# EAGLE design tama2 (1) (EAGLE 6.5.0)
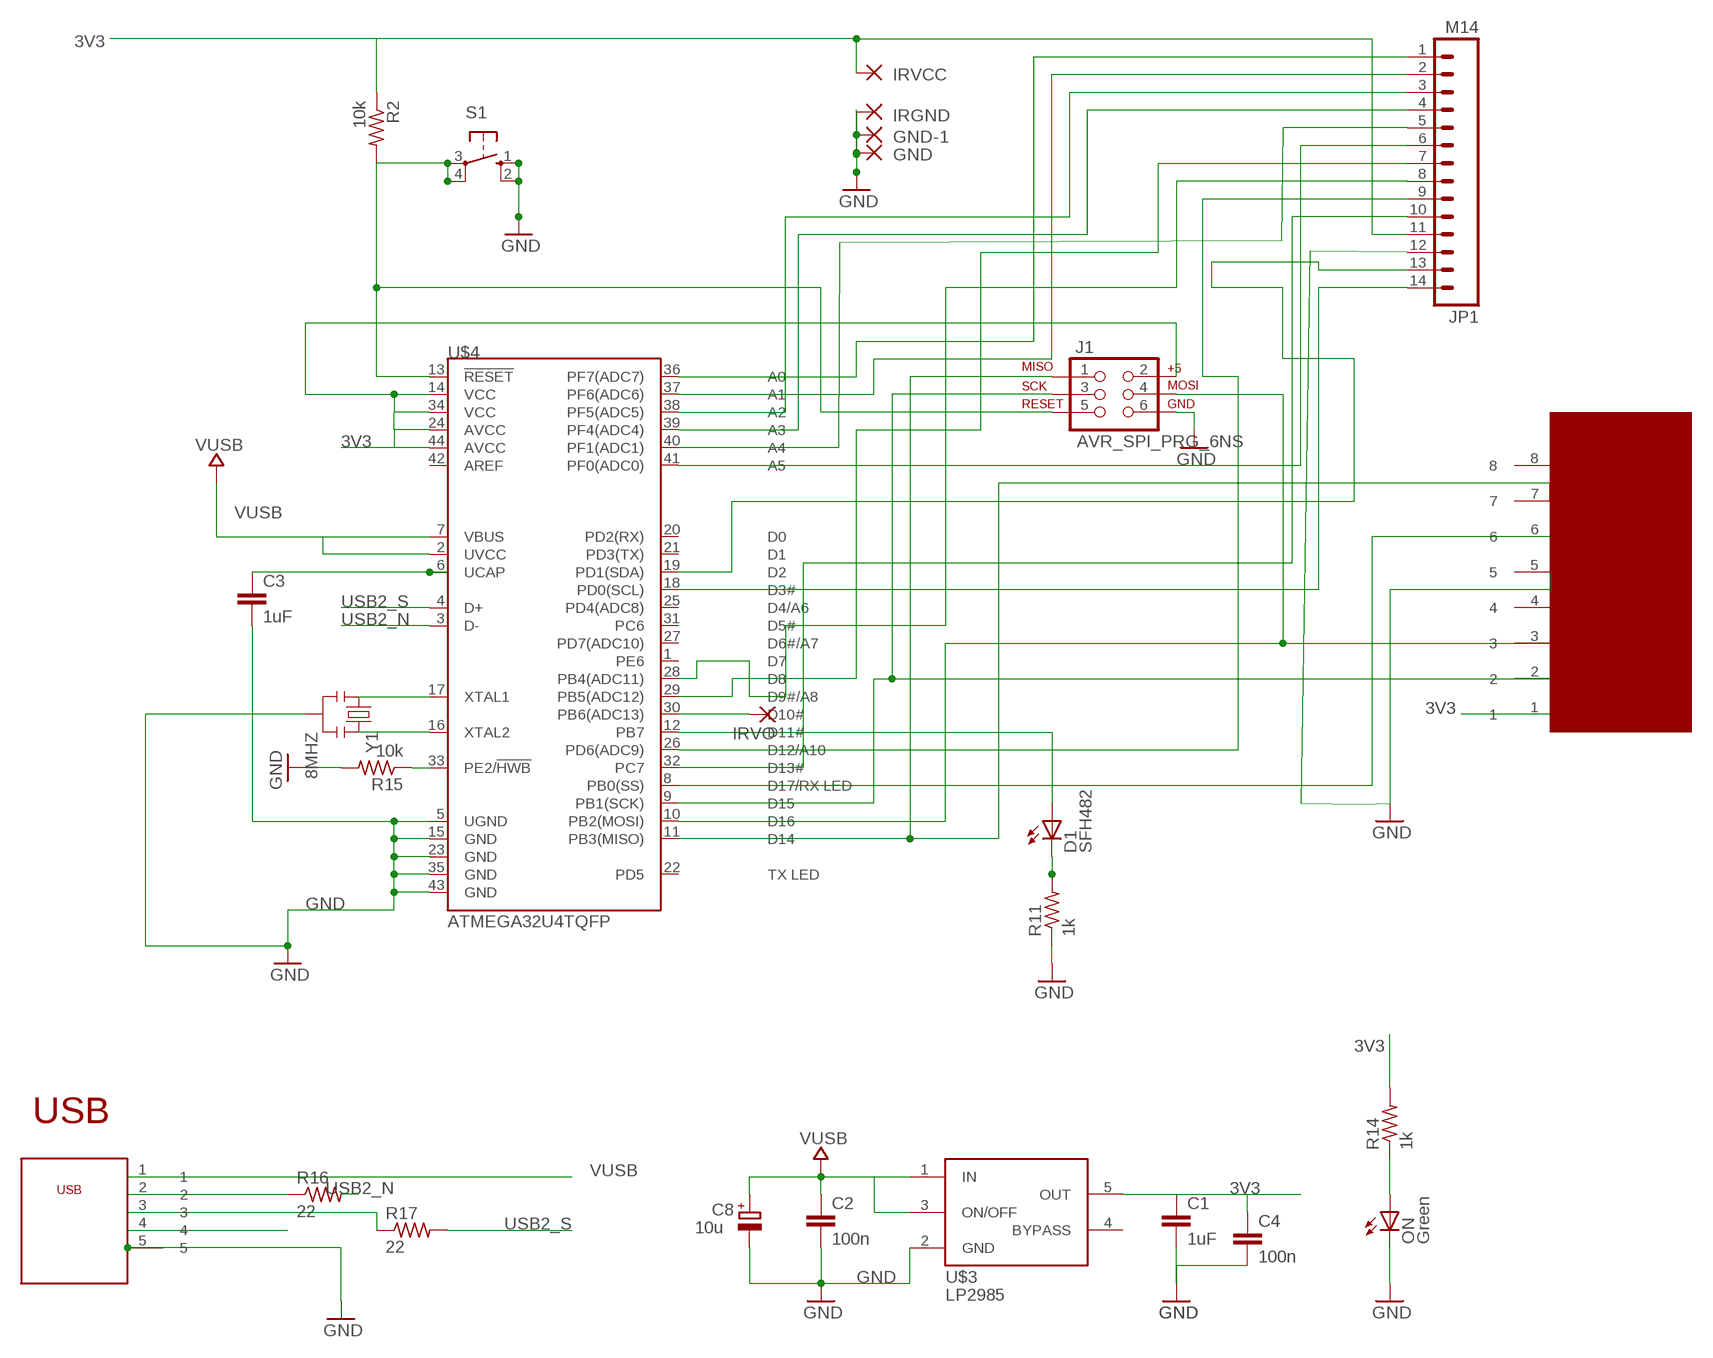
[diagram p0: schematic, sheet 1]

## Parts
C1  1uF  C-EUC1206  [C1206]
C2  100n  C-EUC1206  [C1206]
C3  1uF  C-EUC1206  [C1206]
C4  100n  C-EUC1206  [C1206]
C8  10u  CPOL-EUSMCB  [SMC_B]
D1  SFH482  [SFH482]
GND  2,15/1,0  [2,15/1,0]
GND-1  2,15/1,0  [2,15/1,0]
IRGND  2,15/1,0  [2,15/1,0]
IRVCC  2,15/1,0  [2,15/1,0]
IRVO  2,15/1,0  [2,15/1,0]
J1  AVR_SPI_PRG_6NS  [2X3-NS]
JP1  M14  [1X14]
ON  Green  LEDCHIPLED_0805  [CHIPLED_0805]
R2  10k  R-US_R1206  [R1206]
R11  1k  R-US_R1206  [R1206]
R14  1k  R-US_R1206  [R1206]
R15  10k  R-US_R1206  [R1206]
R16  22  R-US_R1206  [R1206]
R17  22  R-US_R1206  [R1206]
S1  10-XX  [B3F-10XX]
U$1  TAMA  [TAMACONTACT]
U$2  USB  [USB]
U$3  LP2985  [SOT23-5]
U$4  ATMEGA32U4TQFP  [SPARKFUN-DIGITALIC_TQFP44]
Y1  8MHZ  RESONATOR8MHZ  [RESONATOR-SMD]

## Nets
3V3: C1.1 C4.1 IRVCC.1(P) J1.2 JP1.11 R2.1 R14.2 U$1.1 U$3.5(OUT) U$4.14(VCC) U$4.24(AVCC) U$4.34(VCC) U$4.44(AVCC)
GND [gnd]: C1.2 C2.2 C3.2 C4.2 C8.- GND-1.1(P) GND.1(P) IRGND.1(P) J1.6 JP1.12 ON.C R11.1 R15.2 S1.1(S) S1.2(S1) U$1.5 U$2.5 U$3.2(GND) U$4.5(UGND) U$4.15(GND) U$4.23(GND) U$4.35(GND) U$4.43(GND) Y1.2
N$3: ON.A R14.1
N$7: D1.K(C) R11.2
N$15: R15.1 U$4.33(PE2/!HWB)
PB0: U$1.6 U$4.8(PB0(SS))
PB1: J1.3 U$1.2 U$4.9(PB1(SCK))
PB2: J1.4 U$1.3 U$4.10(PB2(MOSI))
PB3: J1.1 U$1.7 U$4.11(PB3(MISO))
PB4: JP1.8 U$4.28(PB4(ADC11))
PB5: JP1.7 U$4.29(PB5(ADC12))
PB6: IRVO.1(P) U$4.30(PB6(ADC13))
PB7: D1.A U$4.12(PB7)
PC7: JP1.10 U$4.32(PC7)
PD0: JP1.14 U$4.18(PD0(SCL))
PD1: JP1.13 U$4.19(PD1(SDA))
PD6: JP1.9 U$4.26(PD6(ADC9))
PF0: JP1.6 U$4.41(PF0(ADC0))
PF1: JP1.5 U$4.40(PF1(ADC1))
PF4: JP1.4 U$4.39(PF4(ADC4))
PF5: JP1.3 U$4.38(PF5(ADC5))
PF6: JP1.2 U$4.37(PF6(ADC6))
PF7: JP1.1 U$4.36(PF7(ADC7))
RESET [usbvcc]: J1.5 R2.2 S1.3(P) S1.4(P1) U$4.13(!RESET)
UCAP: C3.1 U$4.6(UCAP)
USB2_N: R16.2 U$4.3(D-)
USB2_S: R17.2 U$4.4(D+)
USB_N: R16.1 U$2.2
USB_Q: R17.1 U$2.3
USBID: U$2.4
VUSB: C2.1 C8.+ U$2.1 U$3.1(IN) U$3.3(ON/OFF) U$4.2(UVCC) U$4.7(VBUS)
XTAL1: U$4.17(XTAL1) Y1.1
XTAL2: U$4.16(XTAL2) Y1.3
Unconnected: U$1.4 U$1.8 U$3.4(BYPASS) U$4.1(PE6) U$4.20(PD2(RX)) U$4.21(PD3(TX)) U$4.22(PD5) U$4.25(PD4(ADC8)) U$4.27(PD7(ADC10)) U$4.31(PC6) U$4.42(AREF)

## Notes on the sheet
- USB
- C:/Users/Natalie/Documents/egg.bmp

## Library data of the parts
C1-C4 = rcl:C-EU: CAPACITOR, European symbol
C8 = rcl:CPOL-EU: POLARIZED CAPACITOR, European symbol
D1 = led:SFH482: IR LED infrared emitting diode, Infineon
GND GND-1 IRGND IRVCC IRVO = wirepad:2,15/1,0: THROUGH-HOLE PAD
J1 = SparkFun-Connectors:AVR_SPI_PRG_6: AVR ISP 6 Pin This is the reduced ISP connector for AVR programming. Common on Arduino. This footprint will take up less PCB space and can be used with a 10-pin to 6-pin adapter such as SKU: BOB-08508
JP1 = SparkFun-Connectors:M14: Header 14 Standard 14-pin 0.1" header. Use with straight break away headers (SKU : PRT-00116), right angle break away headers (PRT-00553), swiss pins (PRT-00743), machine pins (PRT-00117), and female headers (PRT-00115).
ON = led:LED: LED OSRAM: - CHIPLED LG R971, LG N971, LY N971, LG Q971, LY Q971, LO R971, LY R971 LH N974, LH R974 LS Q976, LO Q976, LY Q976 LO Q996 - Hyper CHIPLED LW Q18S LB Q993, LB Q99A, LB R99A - SideLED LS A670, LO A670, LY A670, LG A670, LP A670 LB A673, LV A673, LT A673, LW A673 LH A674 LY A675 LS A676, LA A676, LO A676, LY A676, LW A676 LS A679, LY A679, LG A679 - Hyper Micro SIDELED® LS Y876, LA Y876, LO Y876, LY Y876 LT Y87S - SmartLED LW L88C, LW L88S LB L89C, LB L89S, LG L890 LS L89K, LO L89K, LY L89K LS L896, LA L896, LO L896, LY L896 - TOPLED LS T670, LO T670, LY T670, LG T670, LP T670 LSG T670, LSP T670, LSY T670, LOP T670, LYG T670 LG T671, LOG T671, LSG T671 LB T673, LV T673, LT T673, LW T673 LH T674 LS T676, LA T676, LO T676, LY T676, LB T676, LH T676, LSB T676, LW T676 LB T67C, LV T67C, LT T67C, LS T67K, LO T67K, LY T67K, LW E67C LS E67B, LA E67B, LO E67B, LY E67B, LB E67C, LV E67C, LT E67C LW T67C LS T679, LY T679, LG T679 LS T770, LO T770, LY T770, LG T770, LP T770 LB T773, LV T773, LT T773, LW T773 LH T774 LS E675, LA E675, LY E675, LS T675 LS T776, LA T776, LO T776, LY T776, LB T776 LHGB T686 LT T68C, LB T68C - Hyper Mini TOPLED® LB M676 - Mini TOPLED Santana® LG M470 LS M47K, LO M47K, LY M47K Source: http://www.osram.convergy.de LUXEON: - LUMILED® LXK2-PW12-R00, LXK2-PW12-S00, LXK2-PW14-U00, LXK2-PW14-V00 LXK2-PM12-R00, LXK2-PM12-S00, LXK2-PM14-U00 LXK2-PE12-Q00, LXK2-PE12-R00, LXK2-PE12-S00, LXK2-PE14-T00, LXK2-PE14-U00 LXK2-PB12-K00, LXK2-PB12-L00, LXK2-PB12-M00, LXK2-PB14-N00, LXK2-PB14-P00, LXK2-PB14-Q00 LXK2-PR12-L00, LXK2-PR12-M00, LXK2-PR14-Q00, LXK2-PR14-R00 LXK2-PD12-Q00, LXK2-PD12-R00, LXK2-PD12-S00 LXK2-PH12-R00, LXK2-PH12-S00 LXK2-PL12-P00, LXK2-PL12-Q00, LXK2-PL12-R00 Source: www.luxeon.com KINGBRIGHT: KA-3528ASYC Source: www.kingbright.com
R2 R11 R14-R17 = resistor:R-US_: RESISTOR, American symbol
S1 = switch-omron:10-XX: OMRON SWITCH; MPN: B3F-1000; OC_FARNELL: 176432; OC_NEWARK: 36M3542
U$1 = tama:TAMA
U$2 = usb:USB
U$3 = kris-verified:LP2985
U$4 = SparkFun-DigitalIC:ATMEGA32U4: Atmel 44-pin 8-bit Microcontroller with 32KBytes of ISP Flash and USB Controller ----- Please use the QFN-44-NOPAD_1:1 package for the footprint of all boards using a 32U4. Route traces directly away from the pads as much as possible.
Y1 = SparkFun-FreqCtrl:RESONATOR: Resonator Small SMD resonator. Used, eg, on the Arduino Pro/ Pro Mini boards. 8MHz- XTAL-08895 16MHz- XTAL-08900; PROD_ID: XTAL-08895

## Net classes
0 default: width 0.254 mm, drill 0.61 mm, clearance 0.254 mm
1 power: width 0.254 mm, drill 0.61 mm, clearance 0.254 mm
2 gnd: width 0.254 mm, drill 0.61 mm, clearance 0.254 mm
3 usbvcc: width 0.254 mm, drill 0.61 mm, clearance 0.254 mm
4 aref: width 0.254 mm, drill 0.61 mm, clearance 0.254 mm

## Board
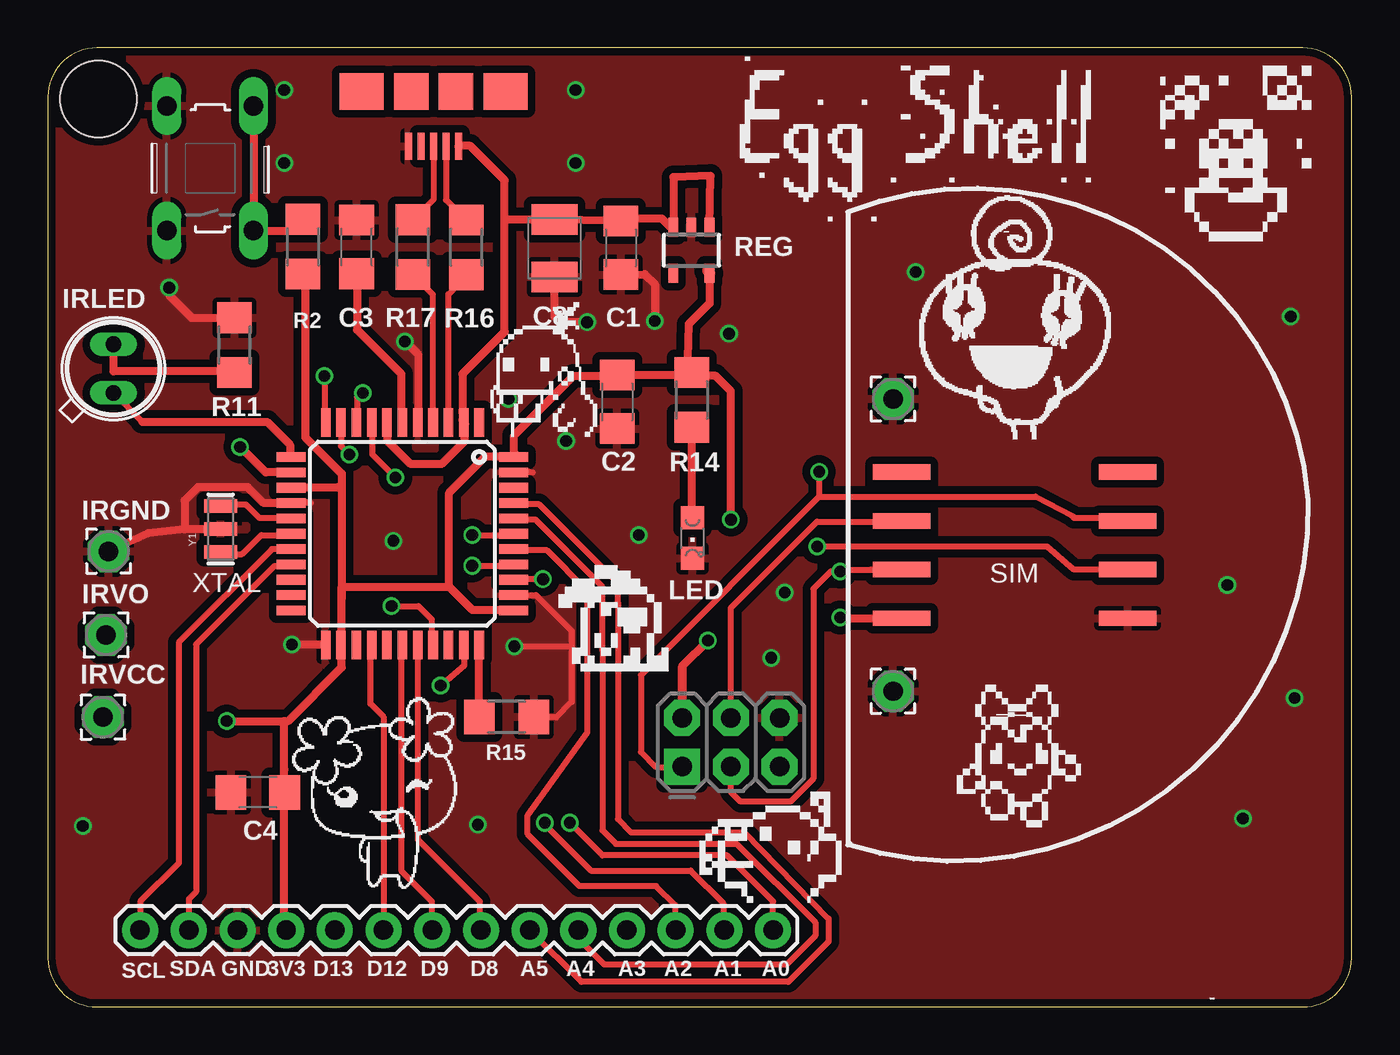
[diagram p1: board, top side]
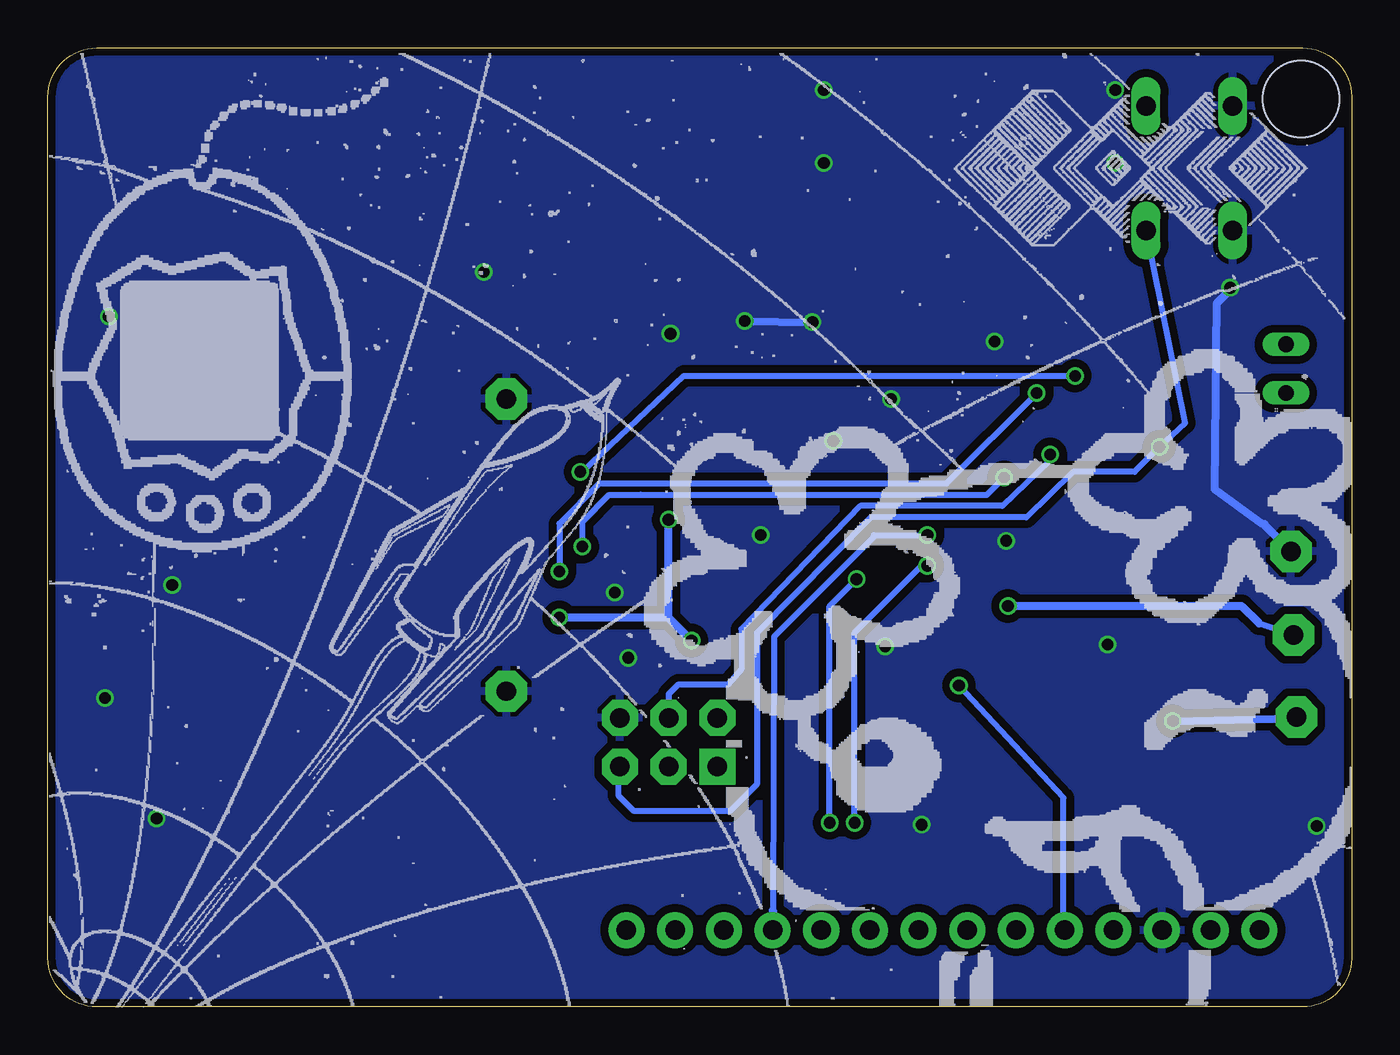
[diagram p2: board, bottom side, seen from below]

Size 68 x 50 mm. Coordinates in mm from the lower left corner, seen from the top.
Outline: 0,47.46 0,2.54 arc90 2.54,0 65.46,0 arc90 68,2.54 68,47.46 arc90 65.46,50 2.54,50 arc90 0,47.46
Copper layers (1*2*15*16): Top 0.035mm / dielectric 0.2mm / layer 2 0.0175mm / dielectric 1.1mm / layer 15 0.0175mm / dielectric 0.2mm / Bottom 0.035mm
Design rules "SeeedStudio_DRU_no_angle_20130527": minimum track width 6mil, minimum drill 12mil, track to track 6mil, track to pad 6mil, pad to pad 6mil, via to via 6mil, smd to smd 0mil, copper to edge 10mil, drill to drill 10mil, minimum pad ring 6mil, minimum via ring 6mil, stop-mask expansion 2mil, vias tented up to drill 25mil, thermal gap 10mil
Holes 4 mm at 2.64,47.35

### Footprints (pad centres in the part's own frame; a part is rotated, then mirrored left to right if it is on the bottom)
C1206 = smd 1.6 x 1.8: 1 -1.4,0; 2 1.4,0
SMC_B = smd 1.6 x 2.4: + -1.5,0; - 1.5,0
SFH482 = drill 0.813 long: A -1.27,0; K 1.27,0
2,15/1,0 = drill 1.016 pad 2.159 octagon: 1 0,0
2X3-NS = drill 1.016 pad 1.88 square: 1 -2.54,-1.27 | drill 1.016 pad 1.88 octagon: 2 -2.54,1.27; 3 0,-1.27; 4 0,1.27; 5 2.54,-1.27; 6 2.54,1.27
1X14 = drill 1.016 pad 1.88: 1 0,0; 2 2.54,0; 3 5.08,0; 4 7.62,0; 5 10.16,0; 6 12.7,0; 7 15.24,0; 8 17.78,0; 9 20.32,0; 10 22.86,0; 11 25.4,0; 12 27.94,0; 13 30.48,0; 14 33.02,0
CHIPLED_0805 = smd 1.2 x 1.2: A 0,-1.05; C 0,1.05
R1206 = smd 1.6 x 1.803: 1 -1.422,0; 2 1.422,0
B3F-10XX = drill 1.016 long: 1 -3.251,2.261; 2 3.251,2.261; 3 -3.251,-2.261; 4 3.251,-2.261
TAMACONTACT = smd 3 x 0.8: 1 0,1.81; 2 0,4.35; 3 0,6.89; 4 0,9.43; 5 11.8,1.81; 6 11.8,4.35; 7 11.8,6.89; 8 11.8,9.43
USB = smd 0.38 x 1.4: 1 -1.3,2.85; 2 -0.65,2.85; 3 0,2.85; 4 0.65,2.85; 5 1.3,2.85 | smd 1.8 x 1.9: P$1 -1.15,0; P$2 1.15,0 | smd 2.3 x 1.9: P$3 -3.75,0; P$5 3.75,0
SOT23-5 = smd 0.5 x 1: 1 -0.95,-1.2; 2 0,-1.2; 3 0.95,-1.2; 4 0.95,1.2; 5 -0.95,1.2
SPARKFUN-DIGITALIC_TQFP44 = smd 1.5 x 0.5: 1 -5.8,4; 2 -5.8,3.2; 3 -5.8,2.4; 4 -5.8,1.6; 5 -5.8,0.8; 6 -5.8,0; 7 -5.8,-0.8; 8 -5.8,-1.6; 9 -5.8,-2.4; 10 -5.8,-3.2; 11 -5.8,-4; 23 5.8,-4; 24 5.8,-3.2; 25 5.8,-2.4; 26 5.8,-1.6; 27 5.8,-0.8; 28 5.8,0; 29 5.8,0.8; 30 5.8,1.6; 31 5.8,2.4; 32 5.8,3.2; 33 5.8,4 | smd 0.5 x 1.5: 12 -4,-5.8; 13 -3.2,-5.8; 14 -2.4,-5.8; 15 -1.6,-5.8; 16 -0.8,-5.8; 17 0,-5.8; 18 0.8,-5.8; 19 1.6,-5.8; 20 2.4,-5.8; 21 3.2,-5.8; 22 4,-5.8; 34 4,5.8; 35 3.2,5.8; 36 2.4,5.8; 37 1.6,5.8; 38 0.8,5.8; 39 0,5.8; 40 -0.8,5.8; 41 -1.6,5.8; 42 -2.4,5.8; 43 -3.2,5.8; 44 -4,5.8
RESONATOR-SMD = smd 0.7 x 1.7: 1 -1.2,0; 2 0,0; 3 1.2,0

### Placement (x,y rotation side)
C1  29.7,31.55 270 top
C2  29.89,39.58 270 top
C3  16.1,39.63 90 top
C4  10.95,11.19 180 top
C8  26.43,39.56 270 top
D1  3.42,33.28 90 top
GND  44.08,16.46 0 top
GND-1  44.08,31.7 0 top
IRGND  3.17,23.75 0 top
IRVCC  2.87,15.1 0 top
IRVO  3.03,19.39 0 top
J1  35.63,13.8 0 top
JP1  37.83,4 180 top
ON  33.62,24.45 180 top
R2  13.3,39.64 90 top
R11  9.74,34.51 270 top
R14  33.58,31.65 90 top
R15  23.93,15.11 0 top
R16  21.83,39.6 270 top
R17  19.03,39.62 270 top
S1  8.46,43.73 90 top
U$1  44.53,18.45 0 top
U$2  20.12,47.72 180 top
U$3  33.56,39.45 180 top
U$4  18.49,24.67 270 top
Y1  9.01,24.91 90 top

### Tracks (layer width: path | path; a pad name or v marks a point on that pad's centre or on a via)
3V3  (via drill 0.61)
  Top 0.305: 44.53,20.2 U$1.1 | 33.53,33.1 R14.2 | 12.73,27.1 U$4.14 | 15.33,18.9 U$4.24 | 24.23,20.7 U$4.34 | 24.33,28.9 U$4.44 | 24.23,28.7 23.23,28.7 | JP1.11
  Top 0.406: 24.29,28.7 U$4.44 23.23,28.7 | 15.33,21.9 15.33,18.9 15.33,17.7 12.53,14.9 12.33,14.9 | 24.23,20.7 23.13,20.7 22.13,20.7 20.93,21.9 | 20.93,21.9 | 15.33,21.9 20.93,21.9 | 24.23,28.7 22.83,28.7 20.93,26.8 20.93,21.9 | v9.33,14.9 12.33,14.9 | U$3.5 34.51,36.68 33.43,35.6 33.33,32.92 | 33.33,32.92 R14.2 33.75,32.9 34.83,32.9 35.63,32.1 v35.63,25.4 | 33.33,32.92 30.13,32.92 | 30.13,32.92 29.97,33.22 C1.1 | 24.33,28.9 24.33,29.8 27.43,32.9 29.9,32.9 30.13,32.92 | R2.1 13.35,38.38 13.43,38.4 13.43,29.7 15.33,27.8 15.33,27.1 | 12.73,27.1 15.13,27.1 15.33,27.1 | 15.33,27.1 15.33,21.3 15.33,21.9 | JP1.11 12.33,4.1 12.33,11.19 | 12.33,14.9 12.33,12.38 12.33,11.19 | 33.13,17.8 33.09,17.76 J1.2 33.13,15.11 33.13,17.8 | v41.33,20.3 41.36,20.26 U$1.1 | 33.13,17.8 v34.43,19.1 | C4.1 12.33,11.19
  Top 0.61: U$3.5 34.43,38.38
  Bottom 0.406: v9.33,14.9 3.97,15.02 2.87,15.02 IRVCC.1 | 35.63,20.3 v41.33,20.3 | v34.43,19.1 35.63,20.3 | 35.63,20.3 v35.63,25.4
GND  (via drill 0.61)
  Top 0.305: U$4.15 12.73,26.3 13.53,26.3 13.7,26.27 | 19.33,30.5 U$4.5 | U$4.43 24.43,27.9 25.13,27.9 25.3,27.87 | U$4.35 25.46,21.47 27.33,19.6 27.33,18.8 | 27.33,18.8 27.33,15.9 26.53,15.1 25.36,15.1 R15.2 | v24.33,18.8 27.33,18.8
  Top 0.406: C2.2 31.13,38.2 31.66,37.67 v31.66,35.76 | v28.13,35.7 26.73,35.7 26.43,36 C8.- | Y1.2 7.13,24.9 | v6.33,37.5 6.33,37.1 7.5,35.93 R11.1 | U$4.15 11.26,26.27 10.43,27.1 7.83,27.1 7.13,26.4 7.13,24.9 | U$4.23 12.66,18.87 12.63,18.9 | 19.33,30.5 19.33,34 v18.63,34.7 | 7.13,24.9 5.25,24.7 IRGND.1
  Bottom 0.406: v31.66,35.76 v28.13,35.7 | v6.33,37.5 6.33,37.4 7.03,36.7 7.14,27 4.63,25.18 4.53,25.18 4.53,25.11 IRGND.1
  other vias: 18.03,24.3 22.43,9.5 1.82,9.43 61.52,21.99 12.73,18.9 62.33,9.82 64.83,36 45.26,38.31 65.03,16.1 12.33,47.8 12.33,44 27.53,47.8 27.53,44 37.73,18.2 24.03,31.7 27.03,29.5 30.83,24.6 35.53,35.1 38.43,21.6
  pour Top (isolate 0.406): 0,0 0,50 68,50 68,0
  pour Bottom (isolate 0.406): 0,0 0,50 68,50 68,0
N$3
  Top 0.406: R14.1 33.58,26.3 ON.A
N$7
  Top 0.406: R11.2 10.31,33.14 3.42,33.14 D1.K
N$15
  Top 0.406: R15.1 22.49,15.12 U$4.33
PB0  (via drill 0.61)
  Top 0.305: v18.13,27.6 17.83,27.9 16.93,28.8 16.93,30.4 U$4.8 | U$1.6 53.62,22.8 53.53,22.8 52.13,24 v40.13,24
  Bottom 0.305: 19.23,26.7 | 19.23,26.7 19.03,26.7 v18.13,27.6 | 19.23,26.7 37.13,26.7 37.03,26.7 38.73,26.7 40.13,25.3 v40.13,24
PB1  (via drill 0.61)
  Top 0.305: v16.43,32 16.23,31.8 16.13,31.8 16.13,30.5 U$4.9 | 42.93,22.8 U$1.2 41.43,22.8 v41.33,22.7 40.83,22.7 39.93,21.8 39.93,11.9 38.73,10.7 36.13,10.7 35.63,11.2 J1.3
  Bottom 0.305: v16.43,32 21.13,27.3 39.23,27.3 41.33,25.2 v41.33,22.7
PB2  (via drill 0.61)
  Top 0.305: U$4.10 15.29,29.24 v15.73,28.8 | J1.4 35.63,20.8 40.13,25.3 44.49,25.3 U$1.3
  Bottom 0.305: v15.73,28.8 15.73,28.5 18.23,26.12 25.63,26.12 31.83,19.7 31.83,17.6 32.53,16.8 35.13,16.8 35.63,16.3 J1.4
PB3  (via drill 0.61)
  Top 0.305: v14.43,32.9 14.43,30.5 U$4.11 | 40.23,26.6 51.53,26.6 53.43,25.6 53.53,25.5 56.23,25.5 56.33,25.4 U$1.7 | v40.23,27.9 40.23,26.6 | 40.23,26.6 30.93,17.3 30.93,13.3 31.73,12.5 33.06,12.5 J1.1
  Bottom 0.305: v40.23,27.9 40.13,27.9 34.83,32.9 v14.43,32.9
PB4
  Top 0.305: 19.93,4 20.03,4 JP1.8 20.03,4.02 20.03,5.5 18.43,7.1 18.43,18.8 U$4.28
PB5
  Top 0.305: U$4.29 19.29,8.74 22.53,5.5 22.53,4.06 JP1.7
PB6  (via drill 0.61)
  Top 0.305: 20.03,20.2 20.03,18.9 U$4.30 | v17.93,20.9 19.33,20.9 20.03,20.2 | 20.03,20.2
  Bottom 0.305: 4.83,20 IRVO.1
  Bottom 0.406: v17.93,20.9 5.73,20.9 4.83,20
PB7
  Top 0.305: 4.93,30.5 D1.A
  Top 0.406: 4.93,30.5 11.43,30.5 12.63,29.3 12.63,28.73 U$4.12
PC7  (via drill 0.61)
  Top 0.305: U$4.32 21.73,18.9 21.73,17.8 v20.48,16.75
  Bottom 0.305: JP1.10 15.03,4 15.03,10.9 v20.48,16.75
PD0
  Top 0.305: U$4.18 11.69,23.87 6.83,19 6.83,7.5 4.83,5.5 4.83,4.02 JP1.14
PD1
  Top 0.305: U$4.19 12.63,23 11.83,23 7.73,18.9 7.73,6 7.35,5.62 JP1.13 7.43,4
PD6
  Top 0.305: U$4.26 16.83,18.8 16.83,15.8 17.51,15.12 JP1.9 17.53,4
PF0
  Top 0.305: U$4.41 24.33,26.2 25.63,26.2 29.73,22.1 29.73,21.1 29.73,9.8 30.43,9.1 36.33,9.1 40.73,4.6 40.73,3.4 38.63,1.3 27.83,1.3 JP1.6
PF1
  Top 0.305: U$4.40 24.33,25.4 25.43,25.4 28.93,21.9 28.93,18.6 28.93,9.2 | JP1.5 27.73,3.9 27.73,3.5 29.03,2.2 38.53,2.2 40.03,3.7 40.03,4.4 35.93,8.5 29.63,8.5 28.93,9.2 | 28.93,9.2
PF4  (via drill 0.61)
  Top 0.305: v22.13,24.6 24.23,24.6 U$4.39
  Bottom 0.305: v22.13,24.6 22.03,24.6 24.93,24.6 24.93,24.5 30.13,19.3 30.18,5.03
  Bottom 0.406: 30.18,5.03 30.21,4.02 JP1.4
PF5
  Top 0.305: 28.13,21.1 28.13,14.3 25.03,10 25.03,9 27.73,6.3 31.73,6.3 32.73,5.3 32.73,4 JP1.3 | U$4.38 24.33,23.8 26.03,23.8 28.13,21.7 28.13,21.1 | 28.13,21.1
PF6  (via drill 0.61)
  Top 0.305: v22.13,23 24.23,23 U$4.37 | 35.23,4 JP1.2 35.23,4.06 35.23,5.4 33.53,7.1 28.33,7.1 25.93,9.5 v25.93,9.6
  Bottom 0.305: 25.93,19.5 | 25.93,19.5 22.43,23 v22.13,23 | v25.93,9.6 25.93,19.5
PF7  (via drill 0.61)
  Top 0.305: v25.83,22.3 24.33,22.3 U$4.36 | JP1.1 37.83,4.8 37.83,5.5 35.43,7.9 28.93,7.9 v27.23,9.6 | JP1.1
  Bottom 0.305: v25.83,22.3 27.23,20.9 v27.23,9.6
RESET  (via drill 0.61)
  Top 0.406: S1.4 S1.3 13.3,40.47 R2.2 | 9.93,29.3 v10.03,29.2 11.36,27.87 U$4.13
  Bottom 0.305: S1.3 8.69,30.43 v10.03,29.2 11.33,27.9 14.53,27.9 16.97,25.52 25.07,25.52 31.03,19.5 31.03,11.6 32.43,10.2 37.43,10.2 38.23,11 38.23,12.47
  Bottom 0.406: 38.23,12.47 J1.5
UCAP
  Top 0.305: 18.43,30.5 U$4.6
  Top 0.406: 18.43,30.5 18.43,33 16.13,35.3 16.13,38.2 C3.1
USB2_N
  Top 0.305: U$4.3 20.89,37.16 21.43,37.7 21.47,37.75 | 21.43,37.8 21.73,38.1 | 21.47,37.75 22.23,38.6 | R16.2 21.47,37.75
  Top 0.406: 21.73,38.1 R16.2
USB2_S
  Top 0.305: R17.2 20.09,37.14 U$4.4
USB_N
  Top 0.305: U$2.2 20.77,42.08 R16.1
USB_Q
  Top 0.305: U$2.3 20.12,42.12 R17.1
VUSB
  Top 0.305: 21.83,30.4 21.73,30.4 U$4.2 21.63,30.6 | 17.73,30.4 U$4.7 | 21.63,30.5 21.63,30.6 | 21.63,30.6 21.63,31.1 21.63,31.6
  Top 0.406: U$3.1 34.57,43.33 32.63,43.27 32.63,40.65 U$3.3 32.47,40.65 32.03,41.1 30.01,41.1 C2.1 23.85,41.08 | 17.73,30.4 17.73,29.5 18.93,28.3 20.53,28.3 21.73,29.5 21.73,29.7 | 21.73,30.4 21.73,29.7 | 21.63,30.6 21.63,33 23.83,35.2 23.83,41.1 | 23.83,41.1 23.83,43.1 22.03,44.9 21.45,44.9 U$2.1 | 21.73,29.7 21.63,31.1 | 23.85,41.08 23.83,41.1 | 23.85,41.08 26.41,41.08 C8.+
XTAL1
  Top 0.305: U$4.17 12.63,24.6 11.13,24.6 10.13,23.6 8.83,23.6 8.73,23.7 Y1.1
XTAL2
  Top 0.305: U$4.16 12.63,25.5 11.03,25.5 10.33,26.2 8.73,26.2 Y1.3

### Text on the board
tPlace: REG | IRLED | C8 | R2 | C3 | R17 | R16 | C1 | R11 | C2 | R14 | IRGND | XTAL | SIM | IRVO | LED | IRVCC | R15 | C4 | SCL | SDA | GND | 3V3 | D13 | D12 | D9 | D8 | A5 | A4 | A3 | A2 | A1 | A0
tStop: Natalie Silvanovich / @natashenka / natashenka@kwartzlab.ca